# Altium schematic sheet Resonance-AA0.SchDoc
size A3
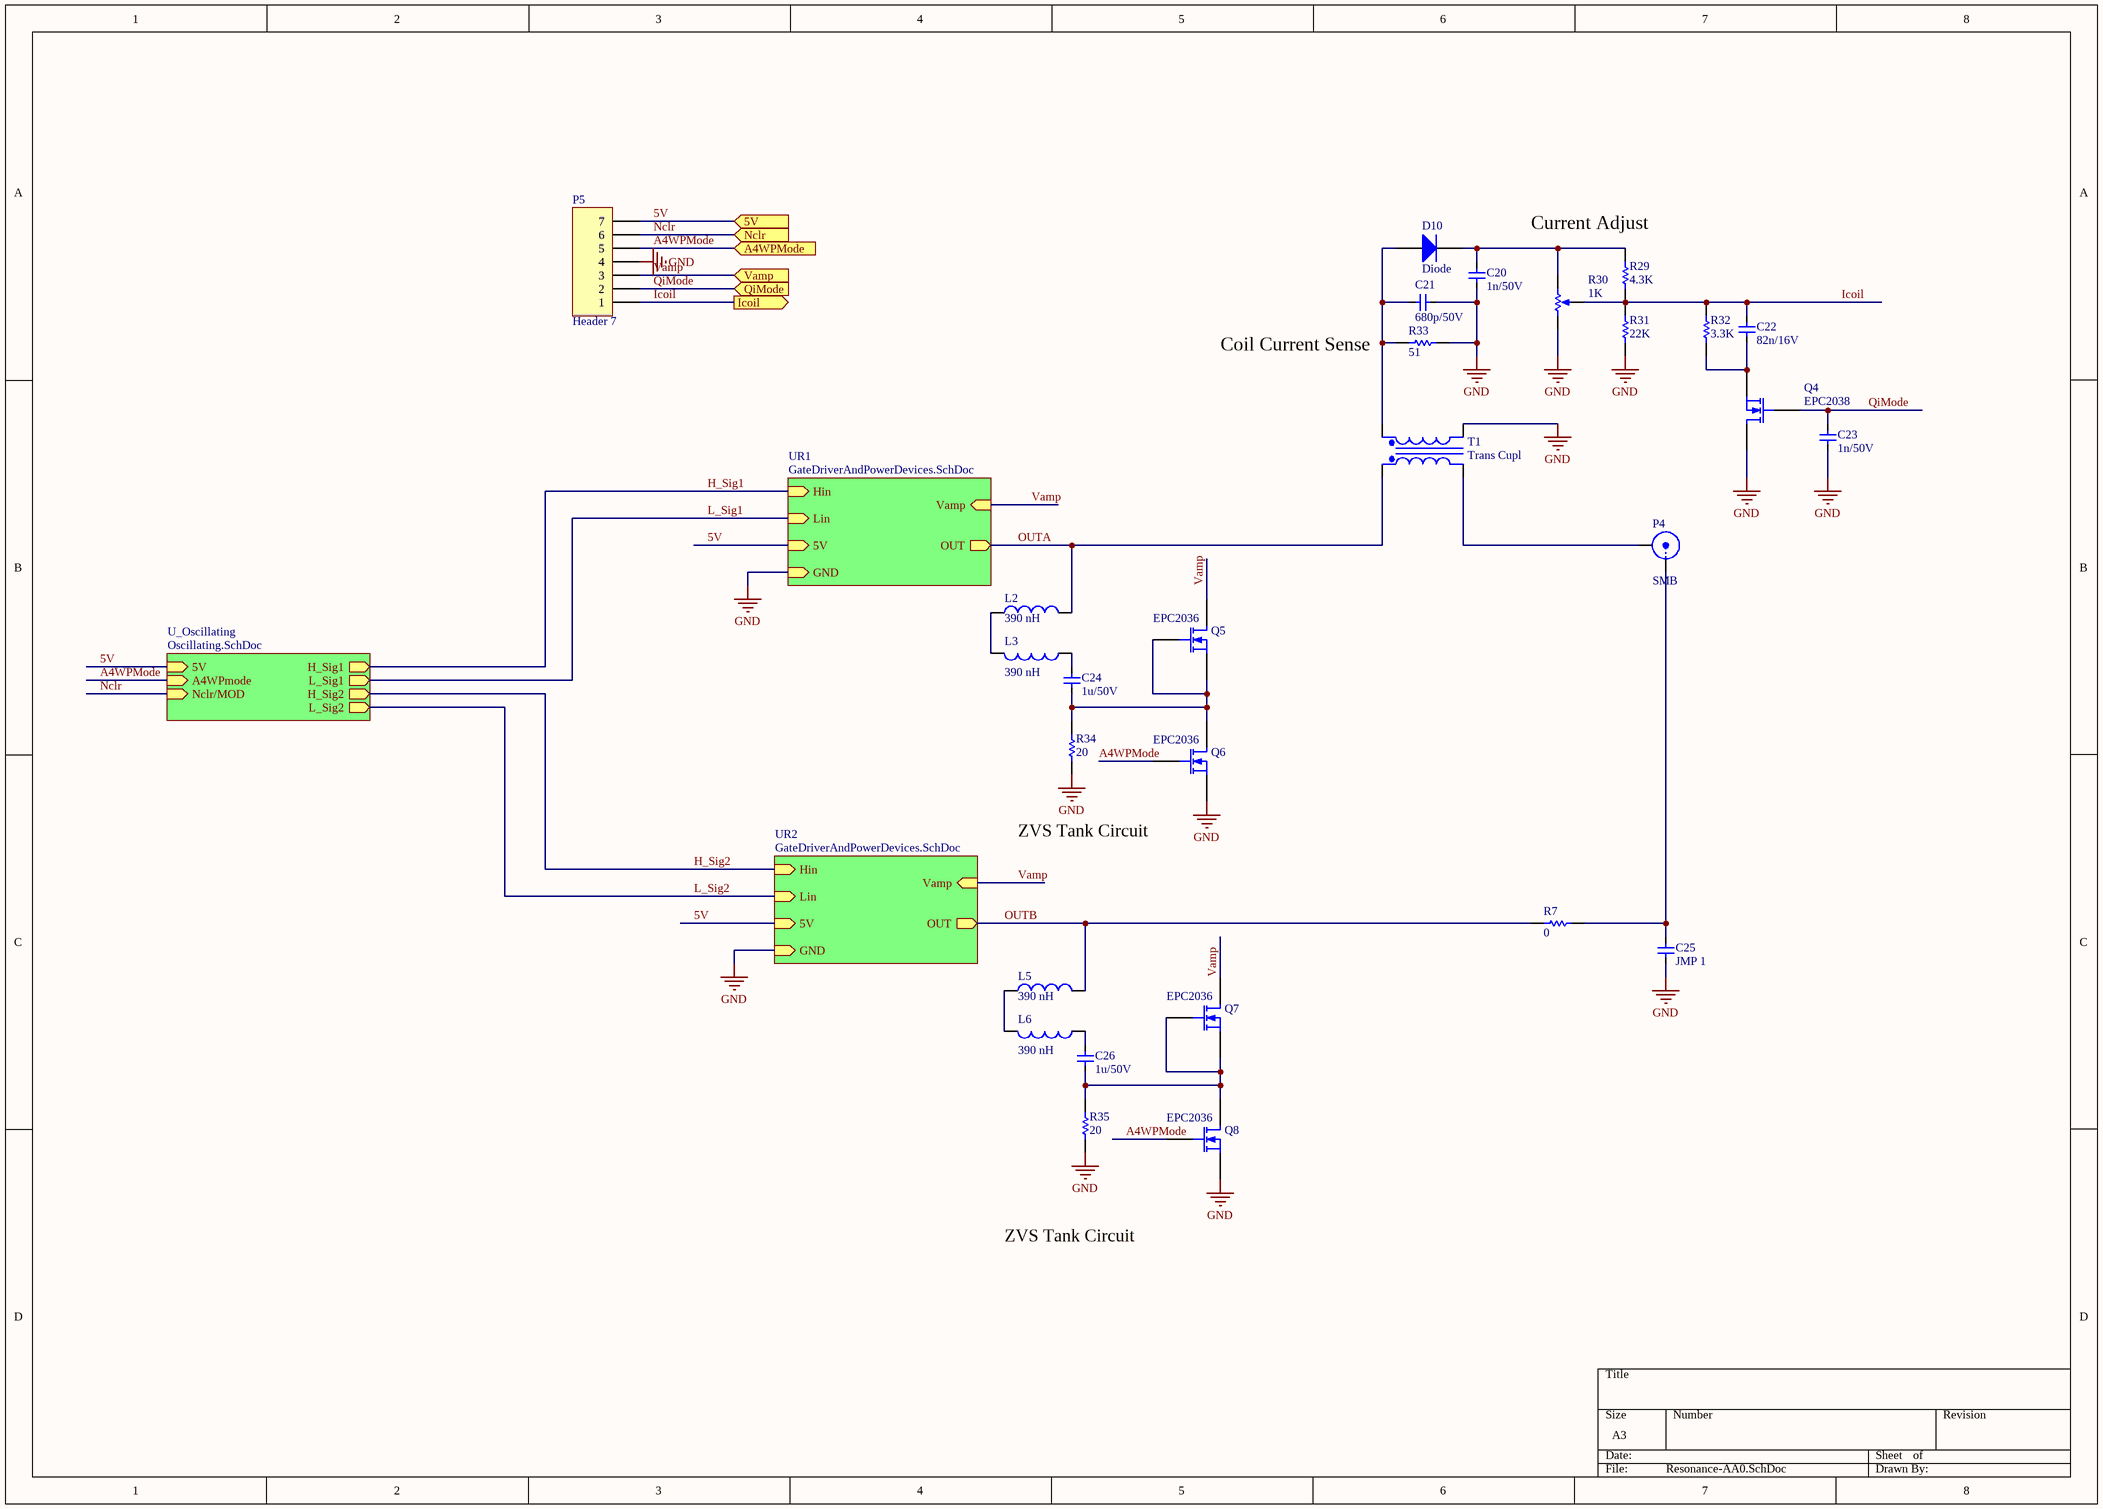
[diagram p0: Resonance-AA0.SchDoc]

## Parts
C20  1n/50V  [0603]
C21  680p/50V  [0603]
C22  82n/16V  [0603]
C23  1n/50V  [0603]
C24  1u/50V  [0603]
C25  JMP 1  [0603]
C26  1u/50V  [0603]
D10  Diode  [SMA]
L2  value 390 nH  [INDP12274X23N]  (hidden comment: Inductor)
L3  value 390 nH  [INDP12274X23N]  (hidden comment: Inductor)
L5  value 390 nH  [INDP12274X23N]  (hidden comment: Inductor)
L6  value 390 nH  [INDP12274X23N]  (hidden comment: Inductor)
P4  SMB  [CONSMA003.062]
P5  Header 7  [HDR1X7]
Q4  EPC2038  [BGA100P9X9-81A]
Q5  EPC2036  [BGA100P9X9-81A]
Q6  EPC2036  [BGA100P9X9-81A]
Q7  EPC2036  [BGA100P9X9-81A]
Q8  EPC2036  [BGA100P9X9-81A]
R7  value 0  [0603]  (hidden comment: Res1)
R29  value 4.3K  [0603]  (hidden comment: Res1)
R30  value 1K  [VR5]  (hidden comment: RPot)
R31  value 22K  [0603]  (hidden comment: Res1)
R32  value 3.3K  [0603]  (hidden comment: Res1)
R33  value 51  [0603]  (hidden comment: Res1)
R34  value 20  [0603]  (hidden comment: Res1)
R35  value 20  [0603]  (hidden comment: Res1)
T1  Trans Cupl  [SOIC127P590X175-4N]

## Sub-sheets
U_Oscillating = Oscillating.SchDoc: 5V (in), H_Sig1 (out), L_Sig1 (out), H_Sig2 (out), L_Sig2 (out), A4WPmode (in), Nclr/MOD (in)
UR1 = GateDriverAndPowerDevices.SchDoc: 5V (in), OUT (out), Hin (in), Lin (in), GND (in), Vamp (in)
UR2 = GateDriverAndPowerDevices.SchDoc: 5V (in), OUT (out), Hin (in), Lin (in), GND (in), Vamp (in)

## Ports
5V (in), A4WPMode (in), Icoil (out), Nclr (in), QiMode (in), Vamp (in)

## Nets
GND: C20.1 C21.2 C23.1 C25.2 P5.4 Q4.1(D) Q6.3(S) Q8.3(S) R30.1(TOP) R31.2 R33.1 R34.1 R35.1 T1.2(Pri-) ; sheet UR1/GND, sheet UR2/GND
5V: P5.7 ; port 5V, sheet UR1/5V, sheet UR2/5V, sheet U_Oscillating/5V
A4WPMode: P5.5 Q6.2(G) Q8.2(G) ; port A4WPMode, sheet U_Oscillating/A4WPmode
H_Sig1: sheet UR1/Hin, sheet U_Oscillating/H_Sig1
H_Sig2: sheet UR2/Hin, sheet U_Oscillating/H_Sig2
Icoil: C22.2 P5.1 R29.2 R30.3(TAP) R31.1 R32.1 ; port Icoil
L_Sig1: sheet UR1/Lin, sheet U_Oscillating/L_Sig1
L_Sig2: sheet UR2/Lin, sheet U_Oscillating/L_Sig2
Nclr: P5.6 ; port Nclr, sheet U_Oscillating/Nclr/MOD
OUTA: L2.2 T1.3(Sec+) ; sheet UR1/OUT
OUTB: L5.2 R7.1 ; sheet UR2/OUT
QiMode: C23.2 P5.2 Q4.2(G) ; port QiMode
Vamp: P5.3 Q5.1(D) Q7.1(D) ; port Vamp, sheet UR1/Vamp, sheet UR2/Vamp
NetC20_2: C20.2 D10.2(K) R29.1 R30.2(BOT)
NetC21_1: C21.1 D10.1(A) R33.2 T1.1(Pri+)
NetC22_1: C22.1 Q4.3(S) R32.2
NetC24_1: C24.1 L3.1
NetC24_2: C24.2 Q5.2(G) Q5.3(S) Q6.1(D) R34.2
NetC25_1: C25.1 P4.1(X) R7.2
NetC26_1: C26.1 L6.1
NetC26_2: C26.2 Q7.2(G) Q7.3(S) Q8.1(D) R35.2
NetL2_1: L2.1 L3.2
NetL5_1: L5.1 L6.2
NetP4_2: P4.2(Y) T1.4(Sec-)

## Notes on the sheet
- (near R29) Current Adjust
- (near R33) Coil Current Sense
- ZVS Tank Circuit

## Library data of the parts
C20-C26 = CAP1: Capacitor
D10 = Diode: Default Diode; Published: 8-Jun-2000; LatestRevisionDate: 17-Jul-2002; LatestRevisionNote: Re-released for DXP Platform.; PackageVersion: Sep-1996; PackageReference: SMC; Publisher: Altium Limited; PackageDescription: DO-214-AB/SMC; 2 C-Bend Leads; Body 7.9 x 5.9 mm, inc. leads (LxW); Code_JEDEC: DO-214-AB
L2 L3 L5 L6 = Inductor: Code_IEC: 1005; Published: 8-Jun-2000; LatestRevisionDate: 29-May-2009; LatestRevisionNote: IPC-7351 Footprint Added.; PackageReference: 0402-A; Publisher: Altium Limited; PackageDescription: Chip Inductor; Code_JEITA: 0402
P4 = SMB: SMB Straight Connector; LatestRevisionDate: 17-Jul-2002; LatestRevisionNote: Re-released for DXP Platform.; Publisher: Altium Limited
P5 = Header 7: Header, 7-Pin; LatestRevisionDate: 17-Jul-2002; LatestRevisionNote: Re-released for DXP Platform.; Publisher: Altium Limited
Q4-Q8 = MOSFET-N: N-Channel MOSFET; Published: 8-Jun-2000; LatestRevisionDate: 17-Jul-2002; LatestRevisionNote: Re-released for DXP Platform.; PackageVersion: 1995/1996; PackageReference: E3; Publisher: Altium Limited; PackageDescription: TO, Flat Index; 3 In-Line, Axial Leads; Body Dia. 4.6mm; Lead Dia. 0.5 mm (max)
R7 R29 R31-R35 = Res1: Resistor; Published: 8-Jun-2000; LatestRevisionDate: 17-Jul-2002; LatestRevisionNote: Re-released for DXP Platform.; PackageReference: AXIAL-0.3; Publisher: Altium Limited; PackageDescription: Axial Device, Thru-Hole; 2 Leads; 0.3 in Pin Spacing
R30 = RPot: Potentiometer; Sim Note: Enter the Resistance value and the set point into parameter fields.; Set Position: 0.5; Published: 8-Jun-2000; LatestRevisionDate: 17-Jul-2002; LatestRevisionNote: Re-released for DXP Platform.; PackageReference: VR5; Publisher: Altium Limited; PackageDescription: Variable Resistor, Thru-Hole; 3 Leads
T1 = Trans Cupl: Transformer (Coupled Inductor Model); Published: 8-Jun-2000; LatestRevisionDate: 17-Jul-2002; LatestRevisionNote: Re-released for DXP Platform.; PackageReference: TRF_4; Publisher: Altium Limited; PackageDescription: Transformer; 4 Leads